# Altium schematic sheet ground-station.SchDoc
size 379 x 394 mm
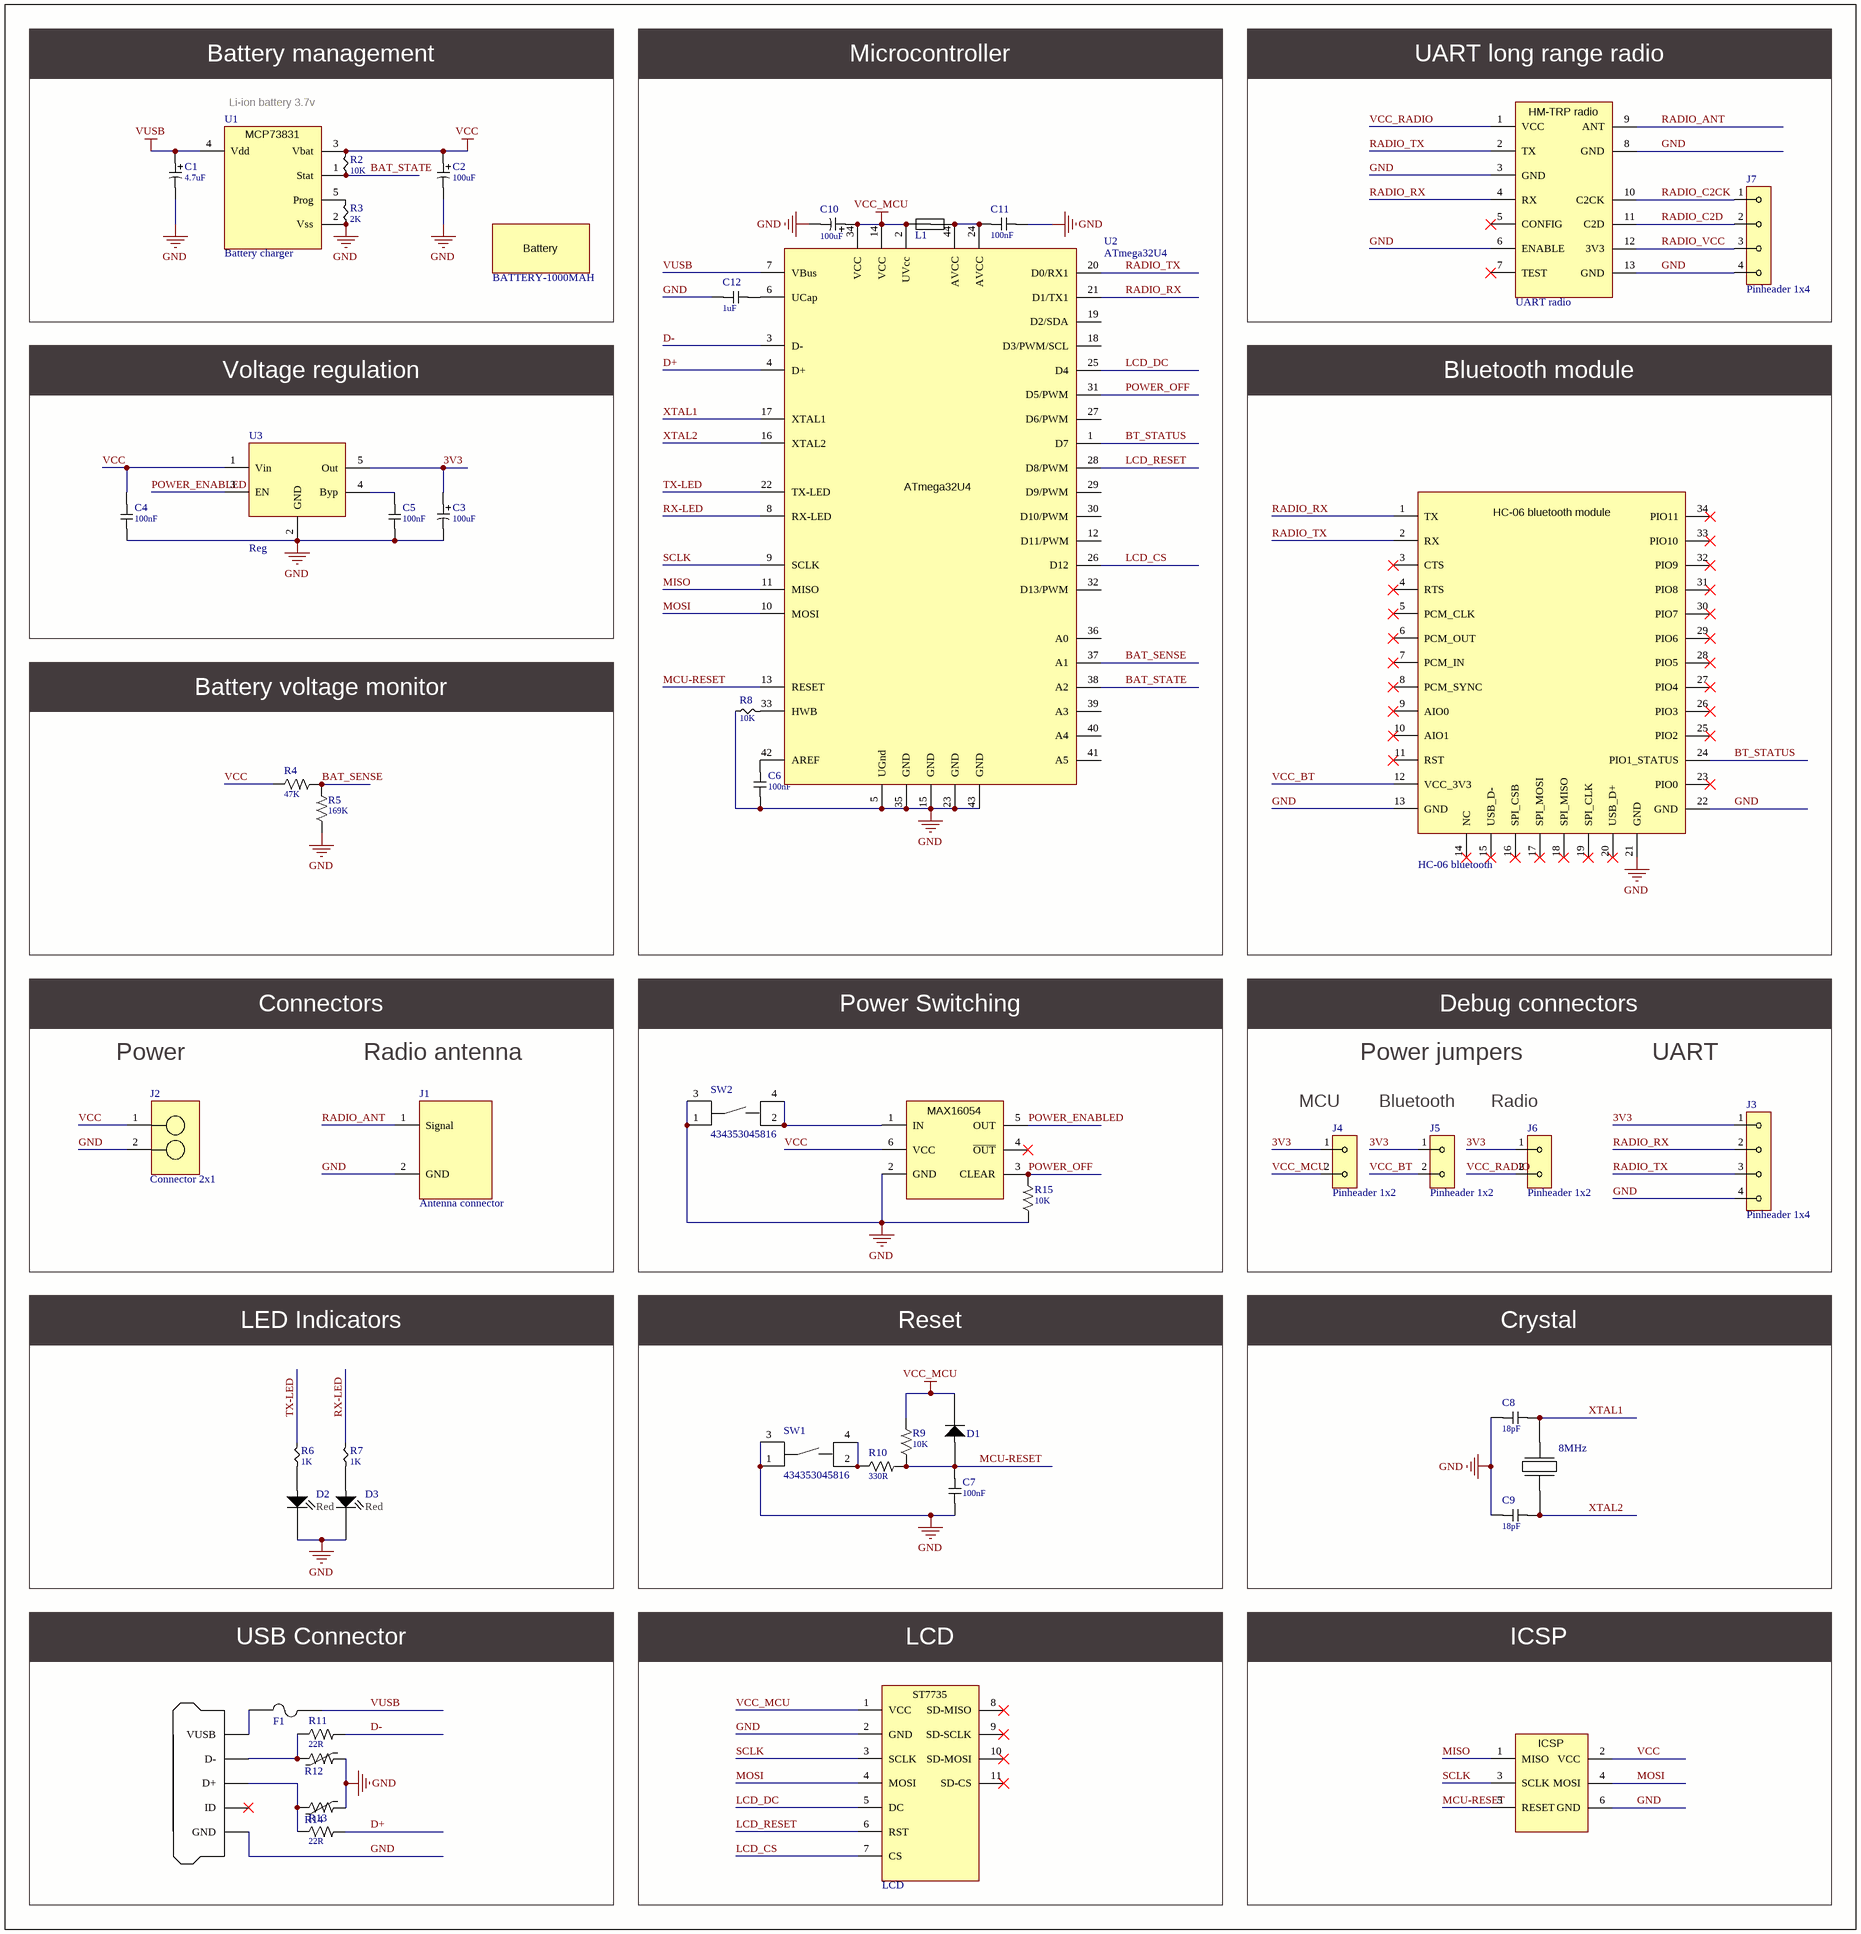
[diagram p0: ground-station.SchDoc]

## Parts
B1  BATTERY-1000MAH  [BATTERY-1000MAH]
BT1  HC-06 bluetooth  [HC-06-BLUETOOTH]
C1  value 4.7uF  [CAP-0603-POL]  (hidden comment: CAPACITOR-POLARIZED)
C2  value 100uF  [CAP-1206-POL]  (hidden comment: CAPACITOR-POLARIZED)
C3  value 100uF  [CAP-1206-POL]  (hidden comment: CAPACITOR-POLARIZED)
C4  value 100nF  [CAP-0603-GEN]  (hidden comment: CAPACITOR)
C5  value 100nF  [CAP-0603-GEN]  (hidden comment: CAPACITOR)
C6  value 100nF  [CAP-0603-GEN]  (hidden comment: CAPACITOR)
C7  value 100nF  [CAP-0603-GEN]  (hidden comment: CAPACITOR)
C8  value 18pF  [CAP-0603-GEN]  (hidden comment: CAPACITOR)
C9  value 18pF  [CAP-0603-GEN]  (hidden comment: CAPACITOR)
C10  value 100uF  [CAP-1206-POL]  (hidden comment: CAPACITOR-POLARIZED)
C11  value 100nF  [CAP-0603-GEN]  (hidden comment: CAPACITOR)
C12  value 1uF  [CAP-0603-GEN]  (hidden comment: CAPACITOR)
D1  DIODE  [DIODE-0603]  (value not drawn)
D2  Color: Red  [LED-0603]  (hidden comment: LED)
D3  Color: Red  [LED-0603]  (hidden comment: LED)
F1  Fuse  [FUSE-0603]  (value not drawn)
ICSP  ICSP  [ICSP-HEADER]  (value not drawn)
J1  Antenna connector  [SMA-PCB]
J2  Connector 2x1  [JST-PH-1x2]
J3  Pinheader 1x4  [PINHEADER-1x4-right-angle]
J4  Pinheader 1x2  [PINHEADER-1x2-SMALL-JUMPER]
J5  Pinheader 1x2  [PINHEADER-1x2-SMALL-JUMPER]
J6  Pinheader 1x2  [PINHEADER-1x2-SMALL-JUMPER]
J7  Pinheader 1x4  [PINHEADER-1x4]
L1  Ferrite bead  [FERRITE-0603]  (value not drawn)
LCD1  LCD  [ST7735]
R1  UART radio  [HM-TRP]
R2  value 10K  [RESISTOR-0603]  (hidden comment: Resistor)
R3  value 2K  [RESISTOR-0603]  (hidden comment: Resistor)
R4  value 47K  [RESISTOR-0603]  (hidden comment: RESISTOR)
R5  value 169K  [RESISTOR-0603]  (hidden comment: RESISTOR)
R6  value 1K  [RESISTOR-0603]  (hidden comment: Resistor)
R7  value 1K  [RESISTOR-0603]  (hidden comment: Resistor)
R8  value 10K  [RESISTOR-0603]  (hidden comment: Resistor)
R9  value 10K  [RESISTOR-0603]  (hidden comment: RESISTOR)
R10  value 330R  [RESISTOR-0603]  (hidden comment: RESISTOR)
R11  value 22R  [RESISTOR-0603]  (hidden comment: RESISTOR)
R12  Varistor  [RESISTOR-0603]  (value not drawn)
R13  value 22R  [RESISTOR-0603]  (hidden comment: RESISTOR)
R14  Varistor  [RESISTOR-0603]  (value not drawn)
R15  value 10K  [RESISTOR-0603]  (hidden comment: RESISTOR)
SW1  434353045816  [WURTH-TACTILE-434353045816]
SW2  434353045816  [WURTH-TACTILE-434353045816]
U1  Battery charger  [SOT23-5]
U2  ATmega32U4  [TQFP44]
U3  Reg  [SOT23-5]
U4  on/off controller  [SOT23-6]  (value not drawn)
USB1  USB Connector  [USB-MICRO-B]  (value not drawn)
Y1  Frequency: 8MHz  [CRYSTAL-5032]  (hidden comment: CRYSTAL)

## Blocks framed on the sheet
Battery management: B1 C1 C2 R2 R3 U1
Microcontroller: C6 C10-C12 L1 R8 U2
UART long range radio: J7 R1
Voltage regulation: C3-C5 U3
Bluetooth module: BT1
Battery voltage monitor: R4 R5
Power Switching: R15 SW2 U4
LED Indicators: D2 D3 R6 R7
Reset: C7 D1 R9 R10 SW1
Crystal: C8 C9 Y1
USB Connector: F1 R11-R14 USB1
LCD: LCD1
ICSP: ICSP

## Nets
GND: BT1.13(GND) BT1.21(GND) BT1.22(GND) C1.2 C2.2 C3.2 C4.1 C5.1 C6.1 C7.1 C8.1 C9.1 C10.2 C11.2 C12.1 D2.2(Cathode) D3.2(Cathode) ICSP.6(GND) J1.2(GND) J2.2 J3.4 J7.4 LCD1.2(GND) R1.3(GND) R1.6(ENABLE) R1.8(GND) R1.13(GND) R3.1 R5.1 R8.1 R12.2 R14.2 R15.1 SW1.1 SW1.3 SW2.1 SW2.3 U1.2(Vss) U2.5(UGnd) U2.15(GND) U2.23(GND) U2.35(GND) U2.43(GND) U3.2(GND) U4.2(GND) USB1.5(GND)
VCC: C2.1 C4.2 ICSP.2(VCC) J2.1 R2.2 R4.1 U1.3(Vbat) U3.1(Vin) U4.6(VCC)
VCC_MCU: C10.1 D1.2(Cathode) J4.2 L1.2 LCD1.1(VCC) R9.2 U2.2(UVcc) U2.14(VCC) U2.34(VCC)
VUSB: C1.1 F1.2 U1.4(Vdd) U2.7(VBus)
3V3: C3.1 J3.1 J4.1 J5.1 J6.1 U3.5(Out)
BAT_SENSE: R4.2 R5.2 U2.37(A1)
BAT_STATE: R2.1 U1.1(Stat) U2.38(A2)
BT_STATUS: BT1.24(PIO1_STATUS) U2.1(D7)
D+: R13.2 U2.4(D+)
D-: R11.2 U2.3(D-)
LCD_CS: LCD1.7(CS) U2.26(D12)
LCD_DC: LCD1.5(DC) U2.25(D4)
LCD_RESET: LCD1.6(RST) U2.28(D8/PWM)
MCU-RESET: C7.2 D1.1(Anode) ICSP.5(RESET) R9.1 R10.2 U2.13(RESET)
MISO: ICSP.1(MISO) U2.11(MISO)
MOSI: ICSP.4(MOSI) LCD1.4(MOSI) U2.10(MOSI)
POWER_ENABLED: U3.3(EN) U4.5(OUT)
POWER_OFF: R15.2 U2.31(D5/PWM) U4.3(CLEAR)
RADIO_ANT: J1.1(Signal) R1.9(ANT)
RADIO_C2CK: J7.1 R1.10(C2CK)
RADIO_C2D: J7.2 R1.11(C2D)
RADIO_RX: BT1.1(TX) J3.2 R1.4(RX) U2.21(D1/TX1)
RADIO_TX: BT1.2(RX) J3.3 R1.2(TX) U2.20(D0/RX1)
RADIO_VCC: J7.3 R1.12(3V3)
RX-LED: R7.2 U2.8(RX-LED)
SCLK: ICSP.3(SCLK) LCD1.3(SCLK) U2.9(SCLK)
TX-LED: R6.2 U2.22(TX-LED)
VCC_BT: BT1.12(VCC_3V3) J5.2
VCC_RADIO: J6.2 R1.1(VCC)
XTAL1: C8.2 U2.17(XTAL1) Y1.2
XTAL2: C9.2 U2.16(XTAL2) Y1.1
NetC5_2: C5.2 U3.4(Byp)
NetC6_2: C6.2 U2.42(AREF)
NetC11_1: C11.1 L1.1 U2.24(AVCC) U2.44(AVCC)
NetC12_2: C12.2 U2.6(UCap)
NetD2_1: D2.1(Anode) R6.1
NetD3_1: D3.1(Anode) R7.1
NetF1_1: F1.1 USB1.1(VUSB)
NetR3_2: R3.2 U1.5(Prog)
NetR8_2: R8.2 U2.33(HWB)
NetR10_1: R10.1 SW1.2 SW1.4
NetR11_1: R11.1 R12.1 USB1.2(D-)
NetR13_1: R13.1 R14.1 USB1.3(D+)
NetSW2_2: SW2.2 SW2.4 U4.1(IN)

Not connected (* = marked no-connect by the designer): BT1 3(CTS)* 4(RTS)* 5(PCM_CLK)* 6(PCM_OUT)* 7(PCM_IN)* 8(PCM_SYNC)* 9(AIO0)* 10(AIO1)* 11(RST)* 14(NC)* 15(USB_D-)* 16(SPI_CSB)* 17(SPI_MOSI)* 18(SPI_MISO)* 19(SPI_CLK)* 20(USB_D+)* 23(PIO0)* 25(PIO2)* 26(PIO3)* 27(PIO4)* 28(PIO5)* 29(PIO6)* 30(PIO7)* 31(PIO8)* 32(PIO9)* 33(PIO10)* 34(PIO11)*; LCD1 8(SD-MISO)* 9(SD-SCLK)* 10(SD-MOSI)* 11(SD-CS)*; R1 5(CONFIG)* 7(TEST)*; U2 12(D11/PWM) 18(D3/PWM/SCL) 19(D2/SDA) 27(D6/PWM) 29(D9/PWM) 30(D10/PWM) 32(D13/PWM) 36(A0) 39(A3) 40(A4) 41(A5); U4 4(~{OUT})*; USB1 4(ID)*

## Notes on the sheet
- Li-ion battery 3.7v
- Connectors
- Debug connectors
- Power
- Radio antenna
- Power jumpers
- UART
- (near J4) MCU
- Bluetooth
- (near J6) Radio
- (in symbol BATTERY-CHARGER-MCP73831) MCP73831
- (in symbol HM-TRP) HM-TRP radio

## Library data of the parts
B1 = BATTERY-1000MAH: Battery
BT1 = HC-06-BLUETOOTH: HC-06 bluetooth module
C1-C3 C10 = CAPACITOR-POLARIZED: Polarized capacitor
ICSP = ICSP: In-circuit serial programmer interface
J1 = ANTENNA-CONNECTOR
J2 = CONNECTOR-1x2: Single row two contact connector
J3 J7 = PINHEADER-1x4: Single row four pin header
J4-J6 = PINHEADER-1x2: Single row two pin header
L1 = FERRITE-BEAD
LCD1 = ST7735: ST7735 color LCD
R1 = HM-TRP: UART long range radio
R2 R3 R6-R8 = RESISTOR-SMALL
SW1 SW2 = WURTH-TACTILE-434353045816: WS-TASU SMD Tact Switch 4.7X3.5 mm side push; Manufacturer: WØ¹rth Elektronik eiSos GmbH & Co.KG; partNo: 434351045816; ComponentLink1 Description: Manufacturer; ComponentLink2 Description: Datasheet; Creat by: Karrer Zheng; NoPins: 04; Creat Date: 6 March February 2014; ComponentLink1URL: http://www.we-online.com; ComponentLink2URL: http://katalog.we-online.de/em/datasheet/434351045816.pdf
U1 = BATTERY-CHARGER-MCP73831: Single cell battery management
U2 = ATmega32U4: 8-bit AVR Microcontroller, 2.7-5.5V, 16MHz, 32KB Flash, 1KB EEPROM, 2.5KB SRAM, USB Controller, 44-pin TQFP, Industrial Grade (-40°C to 85°C), Ext Osc; DatasheetVersion: revF, Nov-2010; PackageVersion: rev.G, Jul-2007; PackageReference: 44ML; PackageDescription: 44-Pin Plastic Thin Quad Flat Pack, 10 x 10 x 1.0 mm Body, 0.8 mm Pitch (TQFP); ComponentLink1Description: Manufacturer URL; ComponentLink1URL: http://www.atmel.com/; ComponentLink2Description: ATmega16U4/32U4 Datasheet; ComponentLink2URL: http://www.atmel.com/dyn/resources/prod_documents/doc7766.pdf; ComponentLink3Description: ATmega16U4 ATmega32U4 Summary; ComponentLink3URL: http://www.atmel.com/dyn/resources/prod_documents/7766S.pdf
U3 = SOT23-REG: Voltage regulator
U4 = MAX16054: Pushbutton on/off controller
USB1 = USB-CONNECTOR
Y1 = CRYSTAL: Crystal oscillator